# EAGLE schematic berta (EAGLE 6.4)
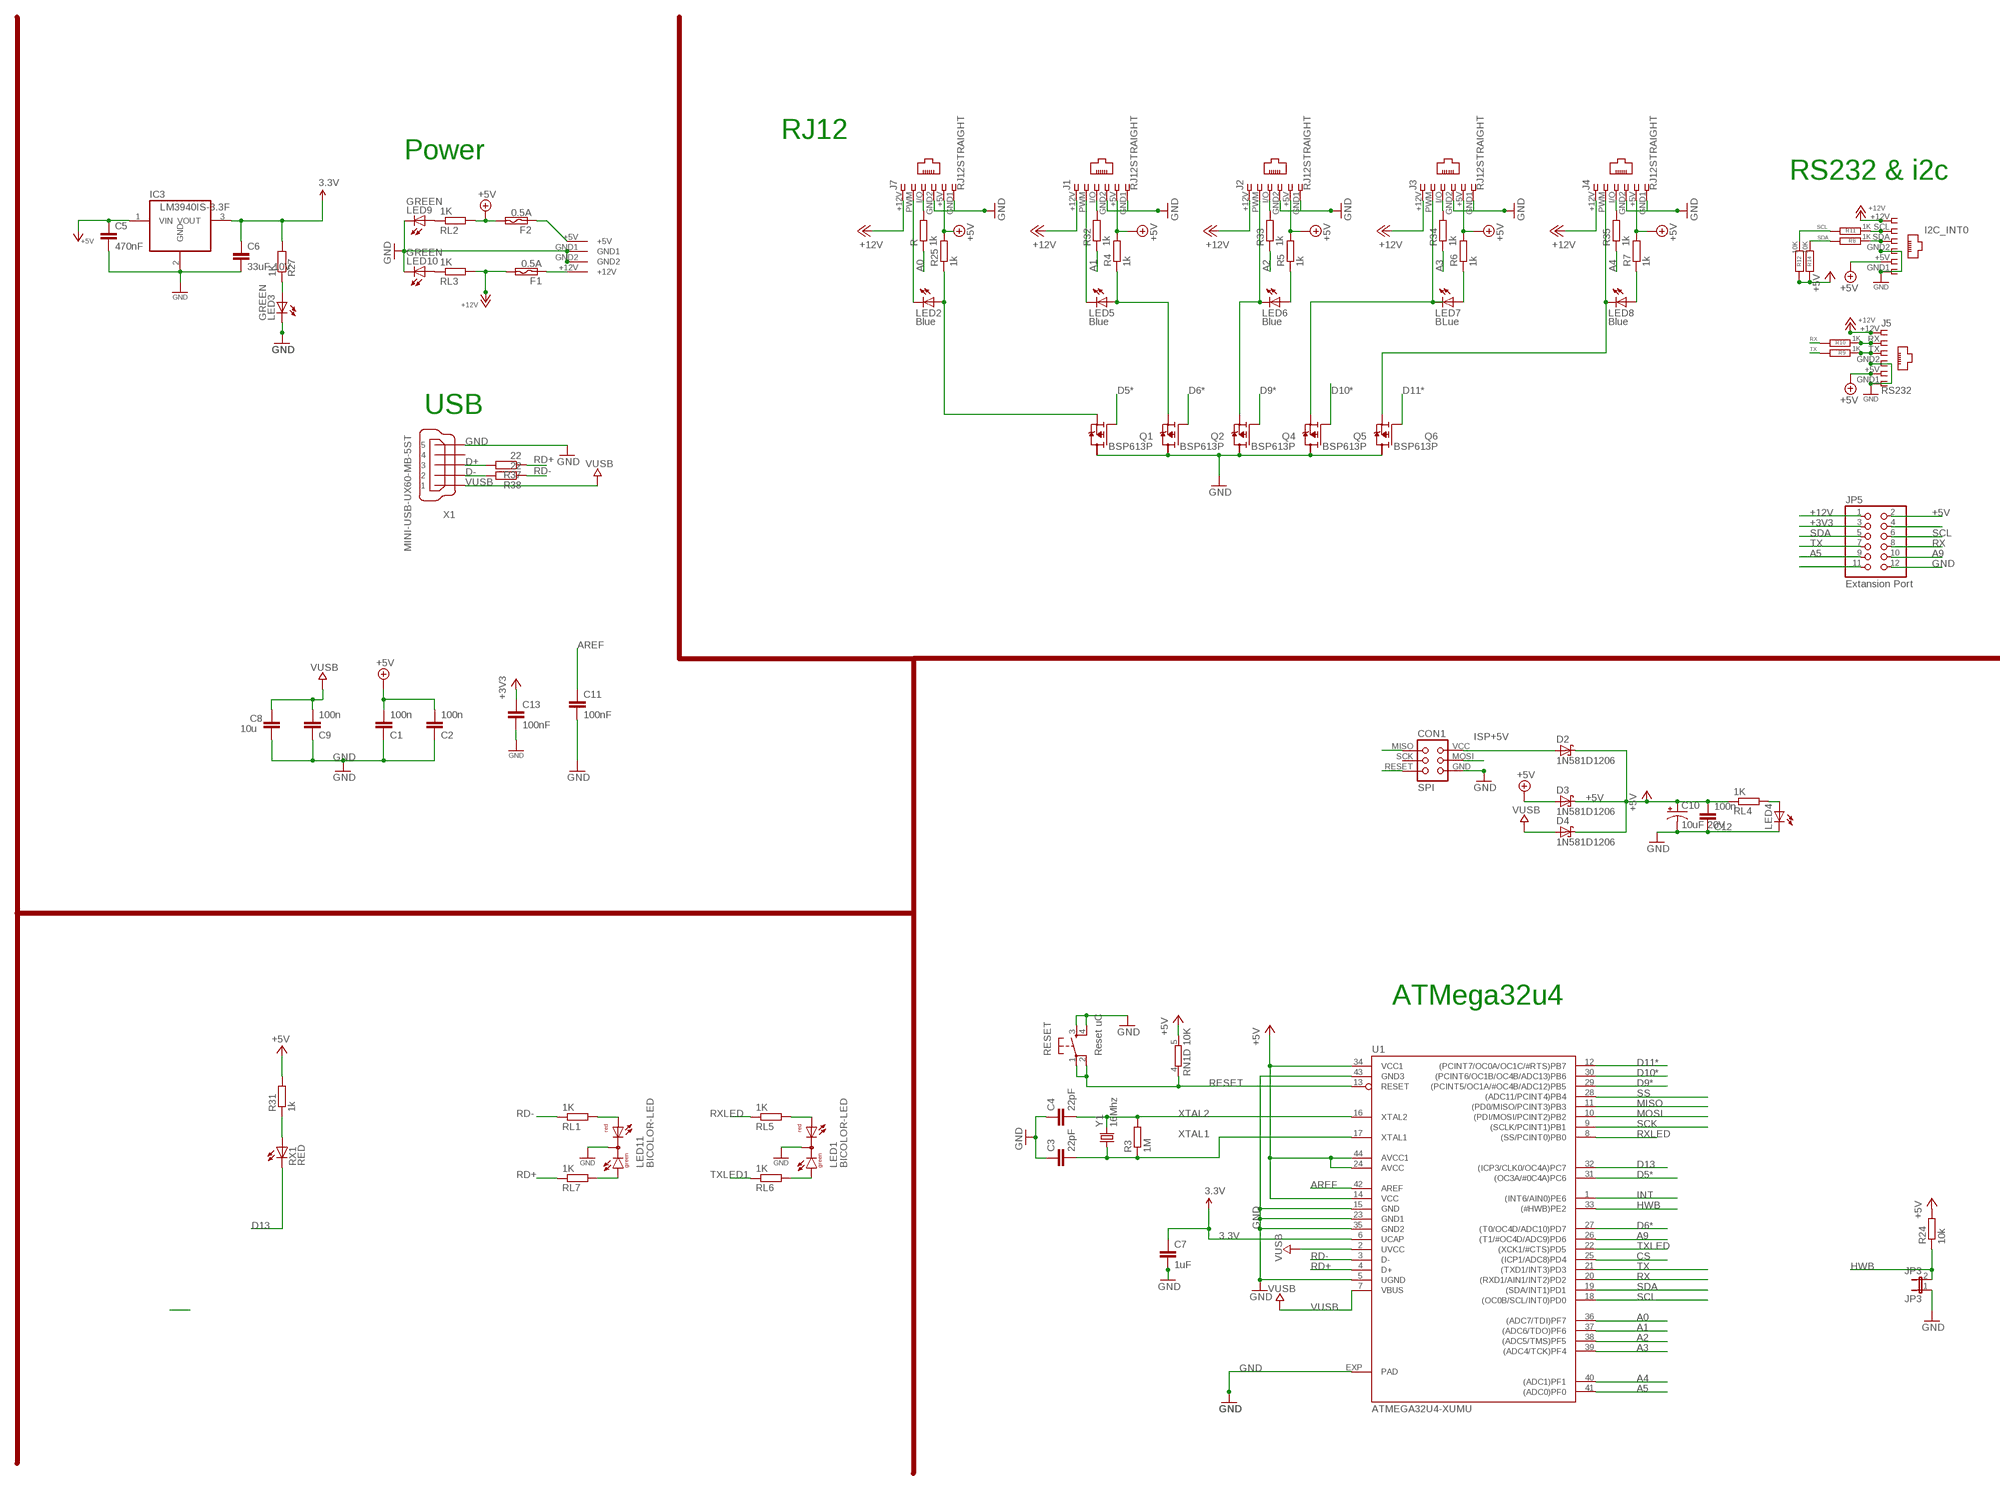
[diagram p0: schematic, sheet 1, part 1 of 2]
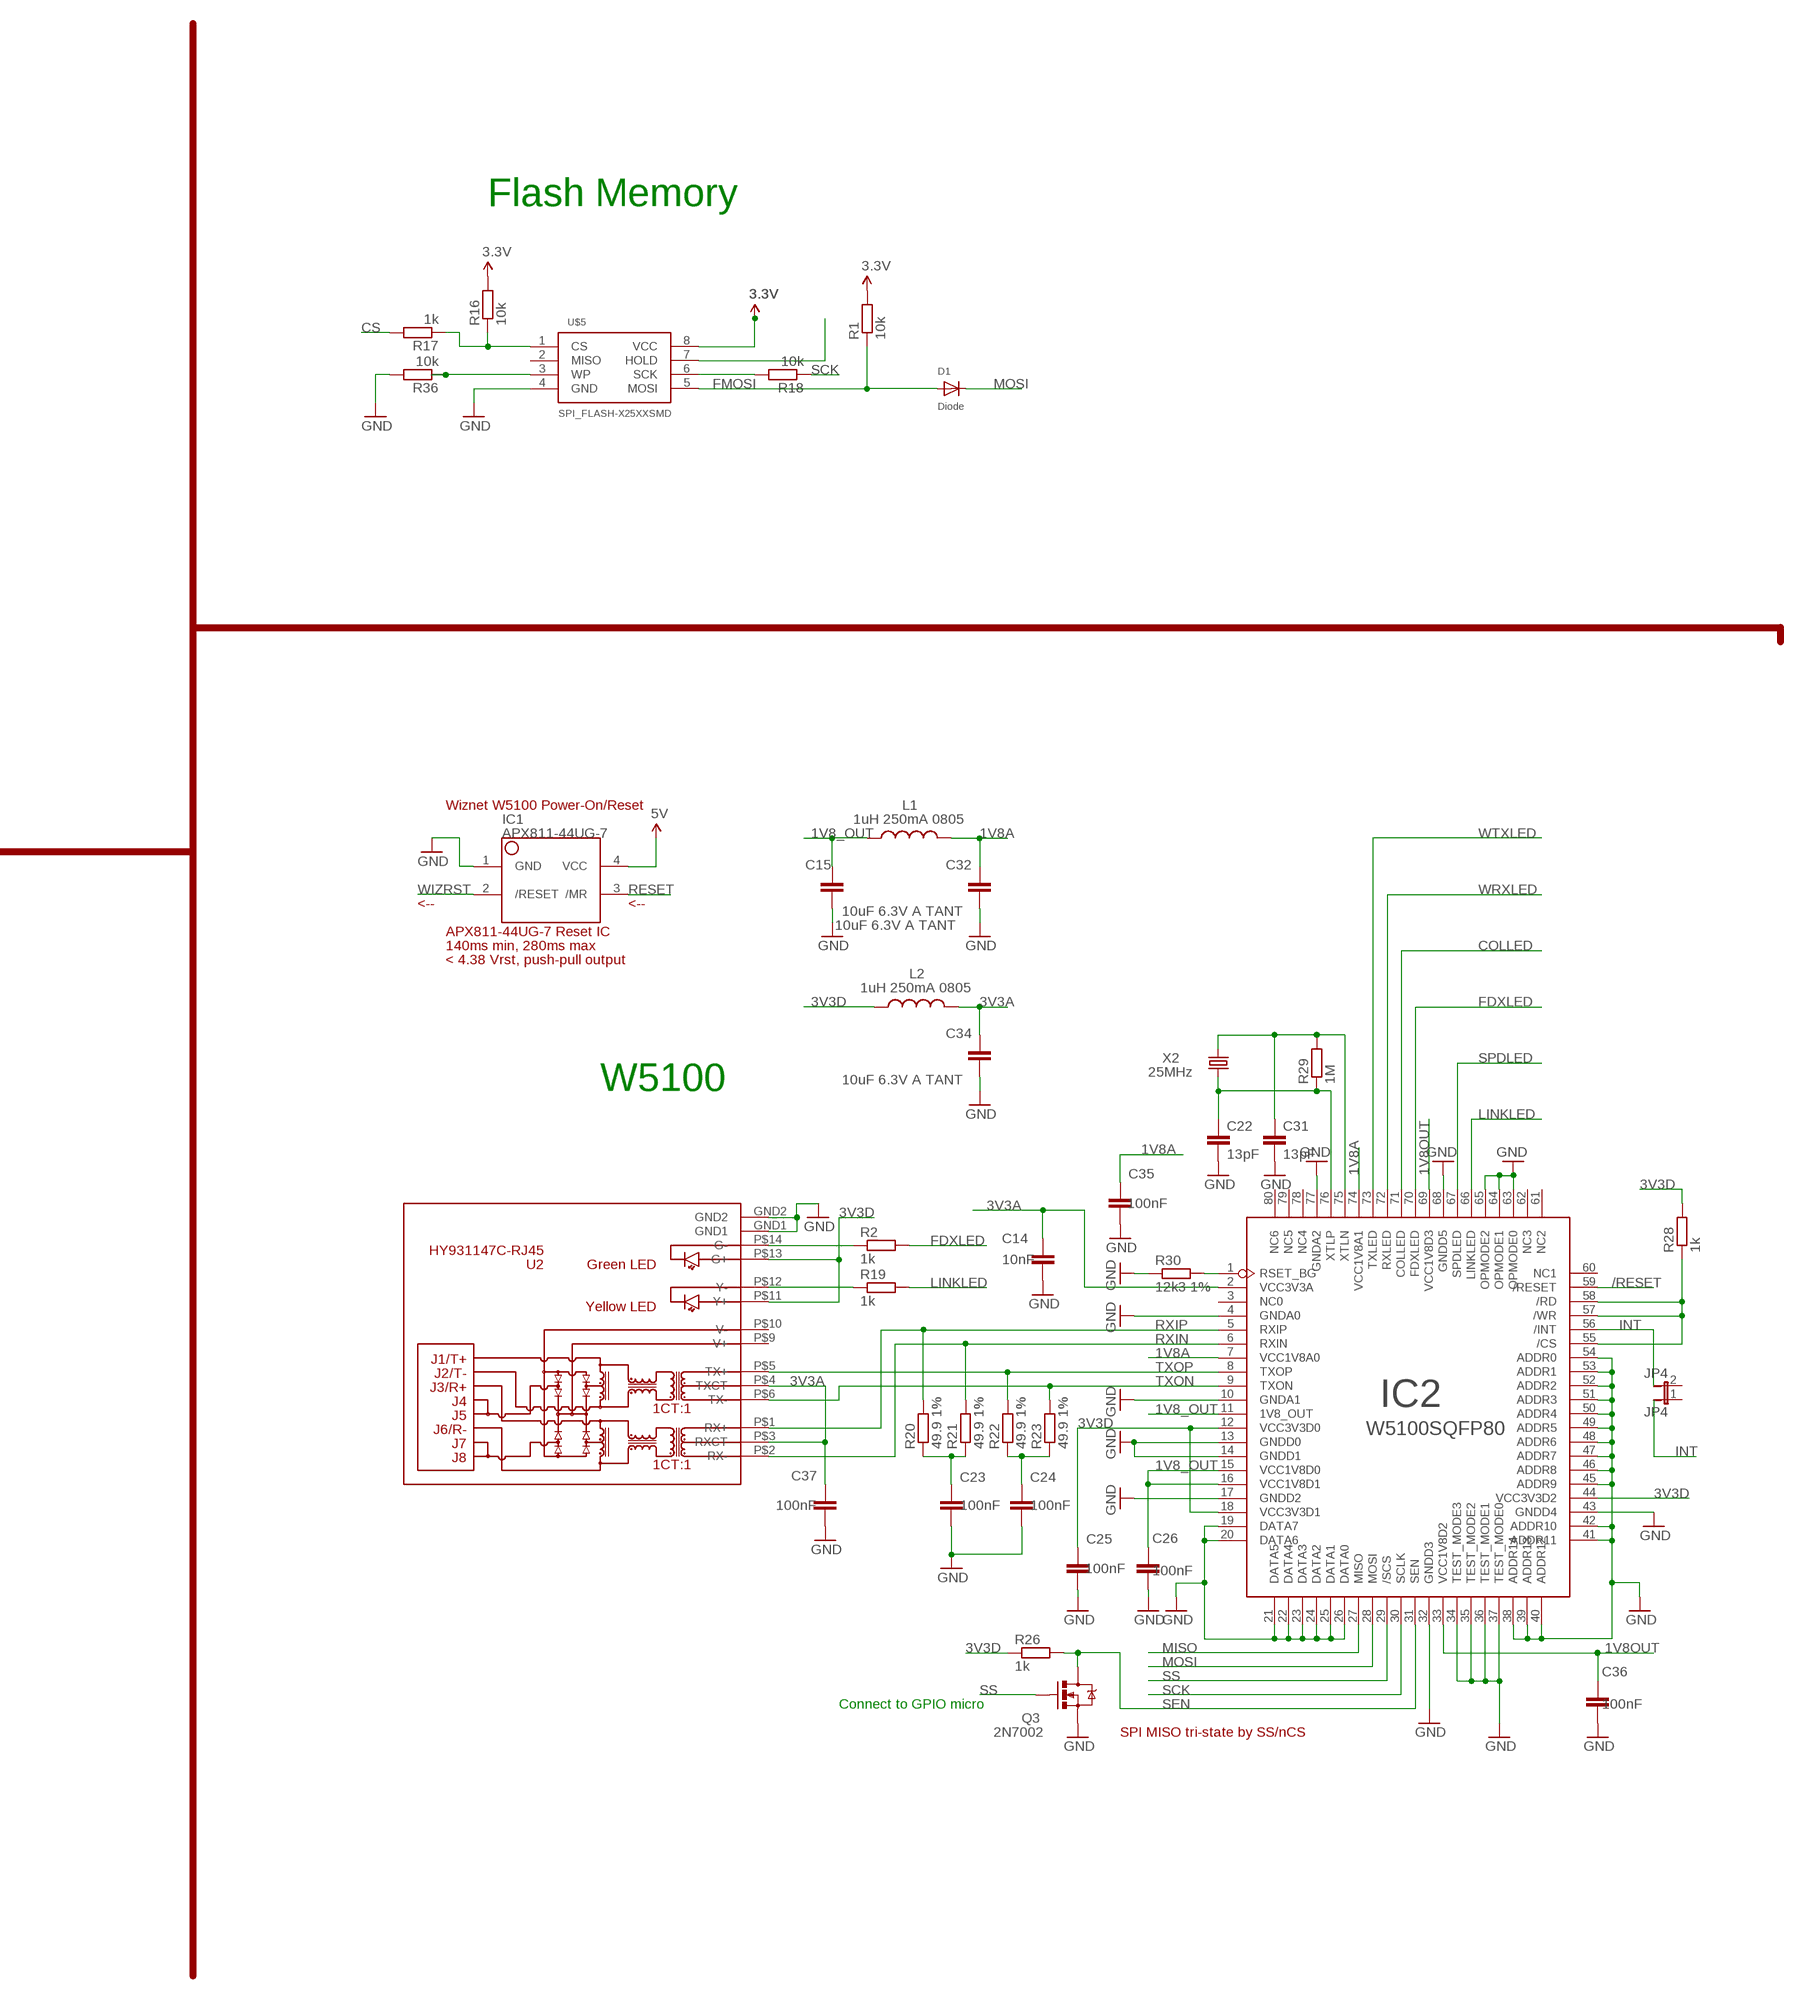
[diagram p1: schematic, sheet 1, part 2 of 2]

## Parts
C1  100n  C-EUC0805  [C0805]
C2  100n  C-EUC0805  [C0805]
C3  22pF  C-EUC0805  [C0805]
C4  22pF  C-EUC0805  [C0805]
C5  470nF  C-EUC0805  [C0805]
C6  33uF 10V  C-EU050-045X075  [C050-045X075]
C7  1uF  C-EUC0805  [C0805]
C8  10u  C-EUC0805  [C0805]
C9  100n  C-EUC0805  [C0805]
C10  10uF 20V  CAP_POL1206-KIT  [EIA3216-KIT]
C11  100nF  C-EUC0805  [C0805]
C12  100n  C-EUC0603  [C0603-ROUND]
C13  100nF  C-EUC0805  [C0805]
C14  10nF  C-EUC0805  [C0805]
C15  10uF 6.3V A TANT  C-EUC0805  [C0805]
C22  13pF  C-EUC0805  [C0805]
C23  100nF  C-EUC0805  [C0805]
C24  100nF  C-EUC0805  [C0805]
C25  100nF  C-EUC0805  [C0805]
C26  100nF  C-EUC0805  [C0805]
C31  13pF  C-EUC0805  [C0805]
C32  10uF 6.3V A TANT  C-EUC0805  [C0805]
C34  10uF 6.3V A TANT  C-EUC0805  [C0805]
C35  100nF  C-EUC0805  [C0805]
C36  100nF  C-EUC0805  [C0805]
C37  100nF  C-EUC0805  [C0805]
CON1  SPI  TINYISP  [TINYISP]
D1  Diode  DIODESMA  [SMADIODE]
D2  1N581D1206  [LED-1206]
D3  1N581D1206  [LED-1206]
D4  1N581D1206  [LED-1206]
F1  0.5A  POLYSWITCHSMD1812  [C1812]
F2  0.5A  POLYSWITCHSMD1812  [C1812]
I2C_INT0  I2C  RJ12STRAIGHT-I2C  [RJ12-STRAIGHT-I2C]
IC1  APX811-44UG-7  APX81X-RESET-IC  [SOT143-R]
IC2  W5100SQFP80  [SQFP80]
IC3  LM3940IS-3.3F  [DD-3]
J1  RJ12STRAIGHT  [RJ12-STRAIGHT]
J2  RJ12STRAIGHT  [RJ12-STRAIGHT]
J3  RJ12STRAIGHT  [RJ12-STRAIGHT]
J4  RJ12STRAIGHT  [RJ12-STRAIGHT]
J5  RS232  RJ12STRAIGHT-RS232-SERVER  [RJ12-STRAIGHT-RS232]
J7  RJ12STRAIGHT  [RJ12-STRAIGHT]
JP3  JP3  JUMPER-2PTH  [1X02]
JP4  JP4  JUMPER-2PTH  [1X02]
JP5  Extansion Port  PINHD-2X6  [2X06]
L1  1uH 250mA 0805  L-USL2012C  [L2012C]
L2  1uH 250mA 0805  L-USL2012C  [L2012C]
LED1  BICOLOR-LED  [BICOLOR-3MM]
LED2  Blue  LEDSML0805  [SML0805]
LED3  GREEN  LEDSML0805  [SML0805]
LED4  LED3MM  [LED3MM]
LED5  Blue  LEDSML0805  [SML0805]
LED6  Blue  LEDSML0805  [SML0805]
LED7  BLue  LEDSML0805  [SML0805]
LED8  Blue  LEDSML0805  [SML0805]
LED9  GREEN  LEDSML0805  [SML0805]
LED10  GREEN  LEDSML0805  [SML0805]
LED11  BICOLOR-LED  [BICOLOR-3MM]
Q1  BSP613P  [PG-SOT-223]
Q2  BSP613P  [PG-SOT-223]
Q3  2N7002  MOSFET-NCHANNELSMD  [SOT23-3]
Q4  BSP613P  [PG-SOT-223]
Q5  BSP613P  [PG-SOT-223]
Q6  BSP613P  [PG-SOT-223]
R  1k  R-EU_M0805  [M0805]
R1  10k  R-EU_M0805  [M0805]
R2  1k  R-EU_R0805W  [R0805W]
R3  1M  R-EU_R0805W  [R0805W]
R4  1k  R-EU_M0805  [M0805]
R5  1k  R-EU_M0805  [M0805]
R6  1k  R-EU_M0805  [M0805]
R7  1k  R-EU_M0805  [M0805]
R8  1K  R-EU_M1206  [M1206]
R9  1K  R-EU_M1206  [M1206]
R10  1K  R-EU_M1206  [M1206]
R11  1K  R-EU_M1206  [M1206]
R12  10K  R-EU_M1206  [M1206]
R14  10K  R-EU_M1206  [M1206]
R16  10k  R-EU_M0805  [M0805]
R17  1k  R-EU_M0805  [M0805]
R18  10k  R-EU_M0805  [M0805]
R19  1k  R-EU_R0805W  [R0805W]
R20  49.9 1%  R-EU_R0805W  [R0805W]
R21  49.9 1%  R-EU_R0805W  [R0805W]
R22  49.9 1%  R-EU_R0805W  [R0805W]
R23  49.9 1%  R-EU_R0805W  [R0805W]
R24  10k  R-EU_R0805W  [R0805W]
R25  1k  R-EU_M0805  [M0805]
R26  1k  R-EU_R0805W  [R0805W]
R27  1K  R-EU_M1206  [M1206]
R28  1k  R-EU_R0805W  [R0805W]
R29  1M  R-EU_R0805W  [R0805W]
R30  12k3 1%  R-EU_R0805W  [R0805W]
R31  1k  R-EU_R0805  [R0805]
R32  1k  R-EU_M0805  [M0805]
R33  1k  R-EU_M0805  [M0805]
R34  1k  R-EU_M0805  [M0805]
R35  1k  R-EU_M0805  [M0805]
R36  10k  R-EU_M0805  [M0805]
R37  22  R-EU_M1206  [M1206]
R38  22  R-EU_M1206  [M1206]
RESET  Reset uC  TAC_SWITCHSMD  [TACTILE_SWITCH_SMD]
RL1  1K  R-EU_M1206  [M1206]
RL2  1K  R-EU_R0805W  [R0805W]
RL3  1K  R-EU_R0805W  [R0805W]
RL4  1K  R-EU_M1206  [M1206]
RL5  1K  R-EU_M1206  [M1206]
RL6  1K  R-EU_M1206  [M1206]
RL7  1K  R-EU_M1206  [M1206]
RN1  10K  4R-NCAY16  [CAY16]
RX1  RED  LEDSML0805  [SML0805]
U1  ATMEGA32U4-XUMU  [QFN44ML7X7]
U2  HY931147C-RJ45  [HY931147C]
U$5  SPI_FLASH-X25XXSMD  [SO08]
U$6  KPJX-4S-S  [KPJX-4S-S]
X1  MINI-USB-UX60-MB-5ST  [UX60-MB-5ST]
X2  25MHz  CRYSTALHC49UV  [HC49U-V]
Y1  16Mhz  CRYSTALHC49US  [HC49US]

## Nets
1V8_OUT: C15.1 C26.1 IC2.11(1V8_OUT) IC2.15(VCC1V8D0) IC2.16(VCC1V8D1) L1.1
1V8A: C32.1 C35.1 IC2.7(VCC1V8A0) IC2.74(VCC1V8A1) L1.2
1V8OUT: C36.1 IC2.33(VCC1V8D2) IC2.69(VCC1V8D3)
3.3V: C6.1 C7.1 IC3.3(VOUT) R1.2 R16.2 R27.2 U1.6(UCAP) U$5.8(VCC)
3V3A: C14.1 C34.1 C37.1 IC2.2(VCC3V3A) L2.2 U2.P$3(RXCT) U2.P$4(TXCT)
3V3D: C25.1 IC2.12(VCC3V3D0) IC2.18(VCC3V3D1) IC2.44(VCC3V3D2) L2.1 R26.1 R28.2 U2.P$11(Y+) U2.P$13(G+)
5V [power]: IC1.4(VCC)
+3V3 [power]: C13.1
+5V [fine]: C1.2 C2.2 C5.1 C10.A(+) C12.2 D2.C D3.A D3.C D4.C F2.2 I2C_INT0.+5V IC3.1(VIN) J1.+5V J2.+5V J3.+5V J4.+5V J5.+5V J7.+5V JP5.2 R4.2 R5.2 R6.2 R7.2 R12.2 R14.2 R24.2 R25.2 R31.2 RL2.2 RL4.1 RN1.5 U1.14(VCC) U1.24(AVCC) U1.34(VCC1) U1.44(AVCC1)
+12V: F1.2 I2C_INT0.+12V J1.+12V J2.+12V J3.+12V J4.+12V J5.+12V J7.+12V RL3.2
/RESET: IC2.59(/RESET)
A0: R.1 U1.36((ADC7/TDI)PF7)
A1: R32.1 U1.37((ADC6/TDO)PF6)
A2: R33.1 U1.38((ADC5/TMS)PF5)
A3: R34.1 U1.39((ADC4/TCK)PF4)
A4: R35.1 U1.40((ADC1)PF1)
A5: JP5.9 U1.41((ADC0)PF0)
A9: JP5.10 U1.26((T1/#OC4D/ADC9)PD6)
AREF: C11.1 U1.42(AREF)
COLLED: IC2.71(COLLED)
CS: R17.2 U1.25((ICP1/ADC8)PD4)
D2B4: I2C_INT0.SDA R8.1
D2B5: J5.TX R9.1
D5*: Q1.1(G) U1.31((OC3A/#0C4A)PC6)
D6*: Q2.1(G) U1.27((T0/OC4D/ADC10)PD7)
D9*: Q4.1(G) U1.29((PCINT5/OC1A/#OC4B/ADC12)PB5)
D10*: Q5.1(G) U1.30((PCINT6/OC1B/OC4B/ADC13)PB6)
D11*: Q6.1(G) U1.12((PCINT7/OC0A/OC1C/#RTS)PB7)
D13: RX1.C U1.32((ICP3/CLK0/OC4A)PC7)
D+: R37.2 X1.3
D-: R38.2 X1.2
FDXLED: IC2.70(FDXLED) R2.2
FMOSI: D1.A R1.1 U$5.5(MOSI)
GND [VIN]: C1.1 C2.1 C3.1 C4.1 C5.2 C6.2 C7.2 C8.2 C9.1 C10.C(-) C11.2 C12.1 C13.2 C14.2 C15.2 C22.2 C23.2 C24.2 C25.2 C26.2 C31.2 C32.2 C34.2 C35.2 C36.2 C37.2 CON1.GND I2C_INT0.GND1 I2C_INT0.GND2 IC1.1(GND) IC2.4(GNDA0) IC2.10(GNDA1) IC2.13(GNDD0) IC2.14(GNDD1) IC2.17(GNDD2) IC2.19(DATA7) IC2.20(DATA6) IC2.21(DATA5) IC2.22(DATA4) IC2.23(DATA3) IC2.24(DATA2) IC2.25(DATA1) IC2.26(DATA0) IC2.32(GNDD3) IC2.34(TEST_MODE3) IC2.35(TEST_MODE2) IC2.36(TEST_MODE1) IC2.37(TEST_MODE0) IC2.38(ADDR14) IC2.39(ADDR13) IC2.40(ADDR12) IC2.41(ADDR11) IC2.42(ADDR10) IC2.43(GNDD4) IC2.45(ADDR9) IC2.46(ADDR8) IC2.47(ADDR7) IC2.48(ADDR6) IC2.49(ADDR5) IC2.50(ADDR4) IC2.51(ADDR3) IC2.52(ADDR2) IC2.53(ADDR1) IC2.54(ADDR0) IC2.63(OPMODE0) IC2.64(OPMODE1) IC2.65(OPMODE2) IC2.68(GNDD5) IC2.77(GNDA2) IC3.2(GND) J1.GND1 J1.GND2 J2.GND1 J2.GND2 J3.GND1 J3.GND2 J4.GND1 J4.GND2 J5.GND1 J5.GND2 J7.GND1 J7.GND2 JP3.1 JP5.12 LED1.2(C) LED3.C LED4.K(C) LED9.C LED10.C LED11.2(C) Q1.2(D) Q2.2(D) Q3.2(S) Q4.2(D) Q5.2(D) Q6.2(D) R30.1 R36.2 RESET.3 RESET.4 U1.5(UGND) U1.15(GND) U1.23(GND1) U1.35(GND2) U1.43(GND3) U1.EXP(PAD) U2.GND1 U2.GND2 U$5.4(GND) U$6.GND1 U$6.GND2 X1.5
HWB: JP3.2 R24.1 U1.33((#HWB)PE2)
INT: IC2.56(/INT) U1.1((INT6/AIN0)PE6)
ISP+5V: CON1.VCC D2.A
LINKLED: IC2.66(LINKLED) R19.2
MISO: CON1.MISO IC2.27(MISO) U1.11((PD0/MISO/PCINT3)PB3)
MOSI: CON1.MOSI D1.C IC2.28(MOSI) U1.10((PDI/MOSI/PCINT2)PB2)
N$1: J2.PWM LED6.C Q4.3(S)
N$2: J1.I/O R32.2
N$3: R31.1 RX1.A
N$4: LED5.A Q2.3(S) R4.1
N$5: J3.PWM LED7.C Q5.3(S)
N$6: U$5.7(HOLD)
N$7: J2.I/O R33.2
N$8: LED11.3(AR) RL1.2
N$9: C24.1 R22.1 R23.1
N$10: R16.1 R17.1 U$5.1(CS)
N$11: R36.1 U$5.3(WP)
N$12: LED4.A RL4.2
N$13: LED1.3(AR) RL5.2
N$14: LED11.1(AG) RL7.2
N$15: LED1.1(AG) RL6.2
N$18: J7.I/O R.2
N$19: J4.PWM LED8.C Q6.3(S)
N$20: LED3.A R27.1
N$21: LED2.A Q1.3(S) R25.1
N$22: LED6.A R5.1
N$23: R18.2 U$5.6(SCK)
N$24: IC2.55(/CS) IC2.57(/WR) IC2.58(/RD) R28.1
N$27: JP5.11
N$28: J1.PWM LED5.C
N$29: J3.I/O R34.2
N$30: LED7.A R6.1
N$31: JP5.4
N$32: J4.I/O R35.2
N$33: LED8.A R7.1
N$34: J7.PWM LED2.C
N$38: F2.1 U$6.+5V
N$39: F1.1 U$6.+12V
N$67: R2.1 U2.P$14(G-)
N$70: J5.RX R10.1
N$71: I2C_INT0.SCL R11.1
N$75: LED10.A RL3.1
N$76: LED9.A RL2.1
N$321: C23.1 R20.1 R21.1
N$322: IC2.1(RSET_BG) R30.2
N$332: R19.1 U2.P$12(Y-)
RD+: R37.1 RL7.1 U1.4(D+)
RD-: R38.1 RL1.1 U1.3(D-)
RESET: CON1.RESET IC1.3(/MR) RESET.1 RESET.2 RN1.4 U1.13(RESET)
RX: JP5.8 R10.2 U1.20((RXD1/AIN1/INT2)PD2)
RXIN: IC2.6(RXIN) R21.2 U2.P$2(RX-)
RXIP: IC2.5(RXIP) R20.2 U2.P$1(RX+)
RXLED: RL5.1 U1.8((SS/PCINT0)PB0)
SCK: IC2.30(SCLK) R18.1 U1.9((SCLK/PCINT1)PB1)
SCL: JP5.6 R11.2 R12.1 U1.18((OC0B/SCL/INT0)PD0)
SDA: JP5.5 R8.2 R14.1 U1.19((SDA/INT1)PD1)
SEN: IC2.31(SEN) Q3.3(D) R26.2
SPDLED: IC2.67(SPDLED)
SS: IC2.29(/SCS) Q3.1(G) U1.28((ADC11/PCINT4)PB4)
TX: JP5.7 R9.2 U1.21((TXD1/INT3)PD3)
TXLED: U1.22((XCK1/#CTS)PD5)
TXLED1: RL6.1
TXON: IC2.9(TXON) R23.2 U2.P$6(TX-)
TXOP: IC2.8(TXOP) R22.2 U2.P$5(TX+)
VUSB: C8.1 C9.2 D4.A U1.2(UVCC) U1.7(VBUS) X1.1
WIZRST: IC1.2(/RESET)
WRXLED: IC2.72(RXLED)
WTXLED: IC2.73(TXLED)
XTAL1: C3.2 R3.1 U1.17(XTAL1) Y1.1
XTAL2: C4.2 R3.2 U1.16(XTAL2) Y1.2
XTLN: C31.1 IC2.75(XTLN) R29.2 X2.2
XTLP: C22.1 IC2.76(XTLP) R29.1 X2.1
Unconnected: CON1.SCK IC2.3(NC0) IC2.60(NC1) IC2.61(NC2) IC2.62(NC3) IC2.78(NC4) IC2.79(NC5) IC2.80(NC6) JP4.1 JP4.2 JP5.1 JP5.3 Q1.4(D) Q2.4(D) Q4.4(D) Q5.4(D) Q6.4(D) RN1.1 RN1.2 RN1.3 RN1.6 RN1.7 RN1.8 U2.P$9(V+) U2.P$10(V-) U$5.2(MISO) X1.4

## Notes on the sheet
- RJ12
- Power
- RS232 & i2c
- Flash Memory
- USB
- Wiznet W5100 Power-On/Reset
- <-- | <--
- APX811-44UG-7 Reset IC
- 140ms min, 280ms max
- < 4.38 Vrst, push-pull output
- W5100
- ATMega32u4
- Connect to GPIO micro
- SPI MISO tri-state by SS/nCS

## Library data of the parts
C1-C9 C11 C13-C15 C22-C26 C31 C32 C34-C37 = rcl:C-EU: CAPACITOR, European symbol
C10 = SparkFun:CAP_POL: Capacitor Polarized These are standard SMD and PTH capacitors. Normally 10uF, 47uF, and 100uF in electrolytic and tantalum varieties. Always verify the external diameter of the through hole cap, it varies with capacity, voltage, and manufacturer. The EIA devices should be standard.
C12 = SmartPrj:C-EU: CAPACITOR, European symbol
CON1 = lpatiny:TINYISP: CONNECTOR; OC_FARNELL: unknown; OC_NEWARK: unknown
D1 = adafruit:DIODE: Diode SMADIODE - SMA Surface Mount Package 20V 1A Schottky Diode Digikey: 641-1014-6-ND DO-1N4148 - Through Hole Small Current Diode SOD-123 20V 1 A (.5mV Vf) Schottky Diode - Digikey: MBRX120TPMSCT-ND SOD-323 10V 570mA (.38mV Vf, 3ns) Schottky Diode - Digikey: ZLLS410CT-ND SOD-523 30V 30mA Schottky Diode (RB751S-40TE61) - Digikey: RB751S-40TE61CT-ND SOT23-R/W - SOT23 Package (R = Solder Paste/Reflow Ovens, W = Hand-Soldering) BAT54Film 40V 300mA - Digikey: 497-7162-1-ND
D2-D4 = lpatiny:1N581*: 1.0A SCHOTTKY BARRIER RECTIFIER Source: http://www.diodes.com/datasheets/ds23001.pdf
F1 F2 = lpatiny:POLYSWITCH: PolySwitch (TM) Resettable Device Source: Data sheet <http://www.farnell.com/datasheets/13482.pdf>
I2C_INT0 J1-J5 J7 = lpatiny:RJ12: CORCOM Modular RJ Jacks No Shield Source: www.tycoelectronics.com .. ENG_DS_1654001_1099_RJ_L_0507.pdf
IC1 = freetronics-master-v1:APX81X-RESET-IC
IC2 = freetronics-marc:W5100: WIZnet W5100
IC3 = lpatiny:LM3940IS-3.3: 1A Low Dropout (LDO) for 5V to 3.3V conversion; MF: TEXAS INSTRUMENTS; MPN: REG1117FAKTTT; OC_FARNELL: 1296120; OC_NEWARK: 87H2562
JP3 JP4 = SparkFun:JUMPER-2: Jumper Basic 0.1" spaced jumper. Use with breakaway headers.
JP5 = pinhead:PINHD-2X6: PIN HEADER
L1 L2 = rcl:L-US: INDUCTOR, American symbol
LED1 LED11 = lpatiny:BICOLOR-LED: T-1(3mm) BI-COLOR INDICATOR LAMP Source: Kingbright .. 2_colour_led_.pdf
LED2 LED3 LED5-LED10 RX1 = led:LED: LED OSRAM: - CHIPLED LG R971, LG N971, LY N971, LG Q971, LY Q971, LO R971, LY R971 LH N974, LH R974 LS Q976, LO Q976, LY Q976 LO Q996 - Hyper CHIPLED LW Q18S LB Q993, LB Q99A, LB R99A - SideLED LS A670, LO A670, LY A670, LG A670, LP A670 LB A673, LV A673, LT A673, LW A673 LH A674 LY A675 LS A676, LA A676, LO A676, LY A676, LW A676 LS A679, LY A679, LG A679 - Hyper Micro SIDELED® LS Y876, LA Y876, LO Y876, LY Y876 LT Y87S - SmartLED LW L88C, LW L88S LB L89C, LB L89S, LG L890 LS L89K, LO L89K, LY L89K LS L896, LA L896, LO L896, LY L896 - TOPLED LS T670, LO T670, LY T670, LG T670, LP T670 LSG T670, LSP T670, LSY T670, LOP T670, LYG T670 LG T671, LOG T671, LSG T671 LB T673, LV T673, LT T673, LW T673 LH T674 LS T676, LA T676, LO T676, LY T676, LB T676, LH T676, LSB T676, LW T676 LB T67C, LV T67C, LT T67C, LS T67K, LO T67K, LY T67K, LW E67C LS E67B, LA E67B, LO E67B, LY E67B, LB E67C, LV E67C, LT E67C LW T67C LS T679, LY T679, LG T679 LS T770, LO T770, LY T770, LG T770, LP T770 LB T773, LV T773, LT T773, LW T773 LH T774 LS E675, LA E675, LY E675, LS T675 LS T776, LA T776, LO T776, LY T776, LB T776 LHGB T686 LT T68C, LB T68C - Hyper Mini TOPLED® LB M676 - Mini TOPLED Santana® LG M470 LS M47K, LO M47K, LY M47K Source: http://www.osram.convergy.de LUXEON: - LUMILED® LXK2-PW12-R00, LXK2-PW12-S00, LXK2-PW14-U00, LXK2-PW14-V00 LXK2-PM12-R00, LXK2-PM12-S00, LXK2-PM14-U00 LXK2-PE12-Q00, LXK2-PE12-R00, LXK2-PE12-S00, LXK2-PE14-T00, LXK2-PE14-U00 LXK2-PB12-K00, LXK2-PB12-L00, LXK2-PB12-M00, LXK2-PB14-N00, LXK2-PB14-P00, LXK2-PB14-Q00 LXK2-PR12-L00, LXK2-PR12-M00, LXK2-PR14-Q00, LXK2-PR14-R00 LXK2-PD12-Q00, LXK2-PD12-R00, LXK2-PD12-S00 LXK2-PH12-R00, LXK2-PH12-S00 LXK2-PL12-P00, LXK2-PL12-Q00, LXK2-PL12-R00 Source: www.luxeon.com KINGBRIGHT: KA-3528ASYC Source: www.kingbright.com
LED4 = lpatiny:LED3MM
Q1 Q2 Q4-Q6 = infineon:BSP613P: SIPMOS (R) Small-Signal-Transistor P-Channel (2 Drain) Source: http://www.infineon.com/dgdl/BSP613P_Rev2.4.pdf; OC_FARNELL: unknown; OC_NEWARK: unknown
Q3 = freetronics:MOSFET-NCHANNEL
R R1-R7 R16-R26 R28-R36 RL2 RL3 = rcl:R-EU_: RESISTOR, European symbol
R8-R12 R14 R27 R37 R38 RL1 RL4-RL7 = resistor:R-EU_: RESISTOR, European symbol
RESET = SparkFun:TAC_SWITCH: Momentary Switch Button commonly used for reset or general input. Spark Fun Electronics SKU : COM-00097
RN1 = resistor-dil:4R-N: Array Chip Resistor Source: RS Component / Phycomp
U1 = SmartPrj:ATMEGA32U4-XU
U2 = freetronics-jon:HY931147C
U$5 = SparkFun:SPI_FLASH-X25XX: 8pin SPI Flash series x25xx. Works with devices like W25X32 and BR25L32
U$6 = lpatiny:KPJX-4S-S
X1 = con-hirose:MINI-USB-: MINI USB Connector Source: http://www.hirose.co.jp/cataloge_hp/e24000019.pdf; OC_FARNELL: unknown; OC_NEWARK: unknown
X2 = freetronics-master-v1:CRYSTAL: Crystals Various standard crystals. Proven footprints. Spark Fun Electronics SKU : COM-00534
Y1 = SparkFun:CRYSTAL: Crystals Various standard crystals. Proven footprints. Spark Fun Electronics SKU : COM-00534

## Net classes
2 VIN: width 0.61 mm, drill 0.61 mm, clearance 0.305 mm
3 fine: width 0.203 mm
4 aref: width 0.254 mm, drill 0.61 mm, clearance 0.254 mm